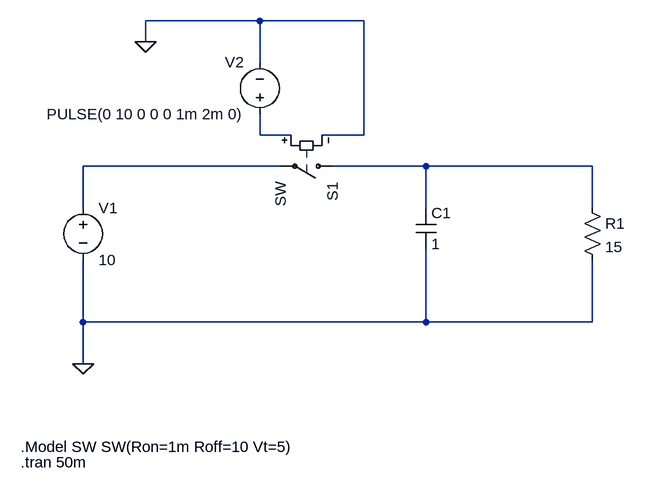
[diagram p0: schematic condenser_v3.asc]
condenser_v3.asc, the LTspice schematic file:
Version 4.1
SHEET 1 880 680
WIRE 224 -144 48 -144
WIRE 384 -144 224 -144
WIRE 48 -112 48 -144
WIRE 224 -80 224 -144
WIRE 224 32 224 0
WIRE 272 32 224 32
WIRE 384 32 384 -144
WIRE 384 32 320 32
WIRE 256 80 -48 80
WIRE 480 80 336 80
WIRE 736 80 480 80
WIRE -48 144 -48 80
WIRE 480 144 480 80
WIRE 736 144 736 80
WIRE -48 320 -48 224
WIRE 480 320 480 208
WIRE 480 320 -48 320
WIRE 736 320 736 224
WIRE 736 320 480 320
WIRE -48 384 -48 320
FLAG 48 -112 0
FLAG -48 384 0
SYMBOL voltage -48 128 R0
WINDOW 123 0 0 Left 0
WINDOW 39 0 0 Left 0
SYMATTR InstName V1
SYMATTR Value 10
SYMBOL voltage 224 16 R180
WINDOW 0 24 96 Left 2
WINDOW 3 24 16 Left 2
WINDOW 123 0 0 Left 0
WINDOW 39 0 0 Left 0
SYMATTR InstName V2
SYMATTR Value PULSE(0 10 0 0 0 1m 2m 0)
SYMBOL cap 464 144 R0
SYMATTR InstName C1
SYMATTR Value 1
SYMBOL res 720 128 R0
SYMATTR InstName R1
SYMATTR Value 15
SYMBOL sw 352 80 R90
SYMATTR InstName S1
TEXT -144 512 Left 2 !.Model SW SW(Ron=1m Roff=10 Vt=5)
TEXT -144 536 Left 2 !.tran 50m

The netlist it stands for:
* condenser_v3.asc
V1 N002 0 10
V2 N001 0 PULSE(0 10 0 0 0 1m 2m 0)
C1 N003 0 1
R1 N003 0 15
S1 N003 N002 N001 0 SW
.Model SW SW(Ron=1m Roff=10 Vt=5)
.tran 50m
.backanno
.end